# Altium schematic sheet power_5V.SchDoc
size A4
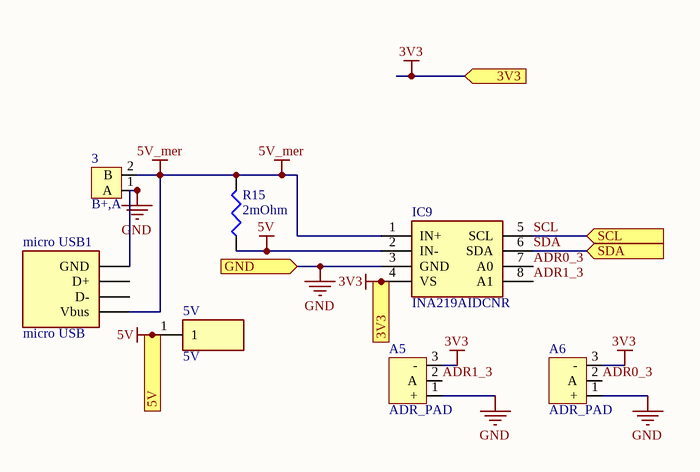
[diagram p0: power_5V.SchDoc]

## Parts
3  B+,A-  [CON_2CH_PLUG]
5V  5V  [1508000150000030]
A5  ADR_PAD  [SOLDER_PAD]
A6  ADR_PAD  [SOLDER_PAD]
IC9  INA219AIDCNR  [SOT65P280X145-8N]
micro_USB1  micro USB  [micro USB]
R15  2mOhm  [RESC3216X75N]

## Ports
3V3 (in), 5V (out), GND (in), SCL (in), SDA (in)

## Nets
3V3: A5.3(-) A6.3(-) IC9.4(VS) ; port 3V3
5V: 5V.1 IC9.2(IN-) R15.1 ; port 5V
5V_mer: 3.2(B) IC9.1(IN+) micro_USB1.1(Vbus) R15.2
GND: 3.1(A) A5.1(+) A6.1(+) IC9.3(GND) micro_USB1.5(GND) ; port GND
ADR0_3: A6.2(A) IC9.7(A0)
ADR1_3: A5.2(A) IC9.8(A1)
SCL: IC9.5(SCL) ; port SCL
SDA: IC9.6(SDA) ; port SDA

Not connected (* = marked no-connect by the designer): micro_USB1 2(D-) 3(D+)

## Library data of the parts
3 = CON_2CH_PLUG: TBG-5.0-KW-2P
5V = 5015: Undefined or Miscellaneous; Manufacturer_Name: Keystone Electronics; Allied_Number: 70182998; Datasheet Link: http://www.keyelco.com/product-pdf.cfm?p=1353; Height: 1.52mm; Manufacturer_Part_Number: 5015; Mouser Part Number: 534-5015; Mouser Price/Stock: https://www.mouser.com/Search/Refine.aspx?Keyword=534-5015; Allied Price/Stock: https://www.alliedelec.com/keystone-electronics-5015/70182998/
A5 A6 = ADR_PAD: ADR PAD 3 PIN
IC9 = INA219BIDCNR: Integrated Circuit; Manufacturer_Name: Texas Instruments; Datasheet Link: http://www.ti.com/lit/ds/symlink/ina219.pdf; Height: 1.45mm; Manufacturer_Part_Number: INA219BIDCNR; Mouser Part Number: 595-INA219BIDCNR; Mouser Price/Stock: https://www.mouser.com/Search/Refine.aspx?Keyword=595-INA219BIDCNR
R15 = Res3: Resistor; Published: 8-Jun-2000; LatestRevisionDate: 29-May-2009; LatestRevisionNote: IPC-7351 Footprint Added.; PackageReference: J1-0603; Publisher: Altium Limited; PackageDescription: Chip Resistor; Value: 2mOhm